# EAGLE design carret (EAGLE 5.11)
A: a
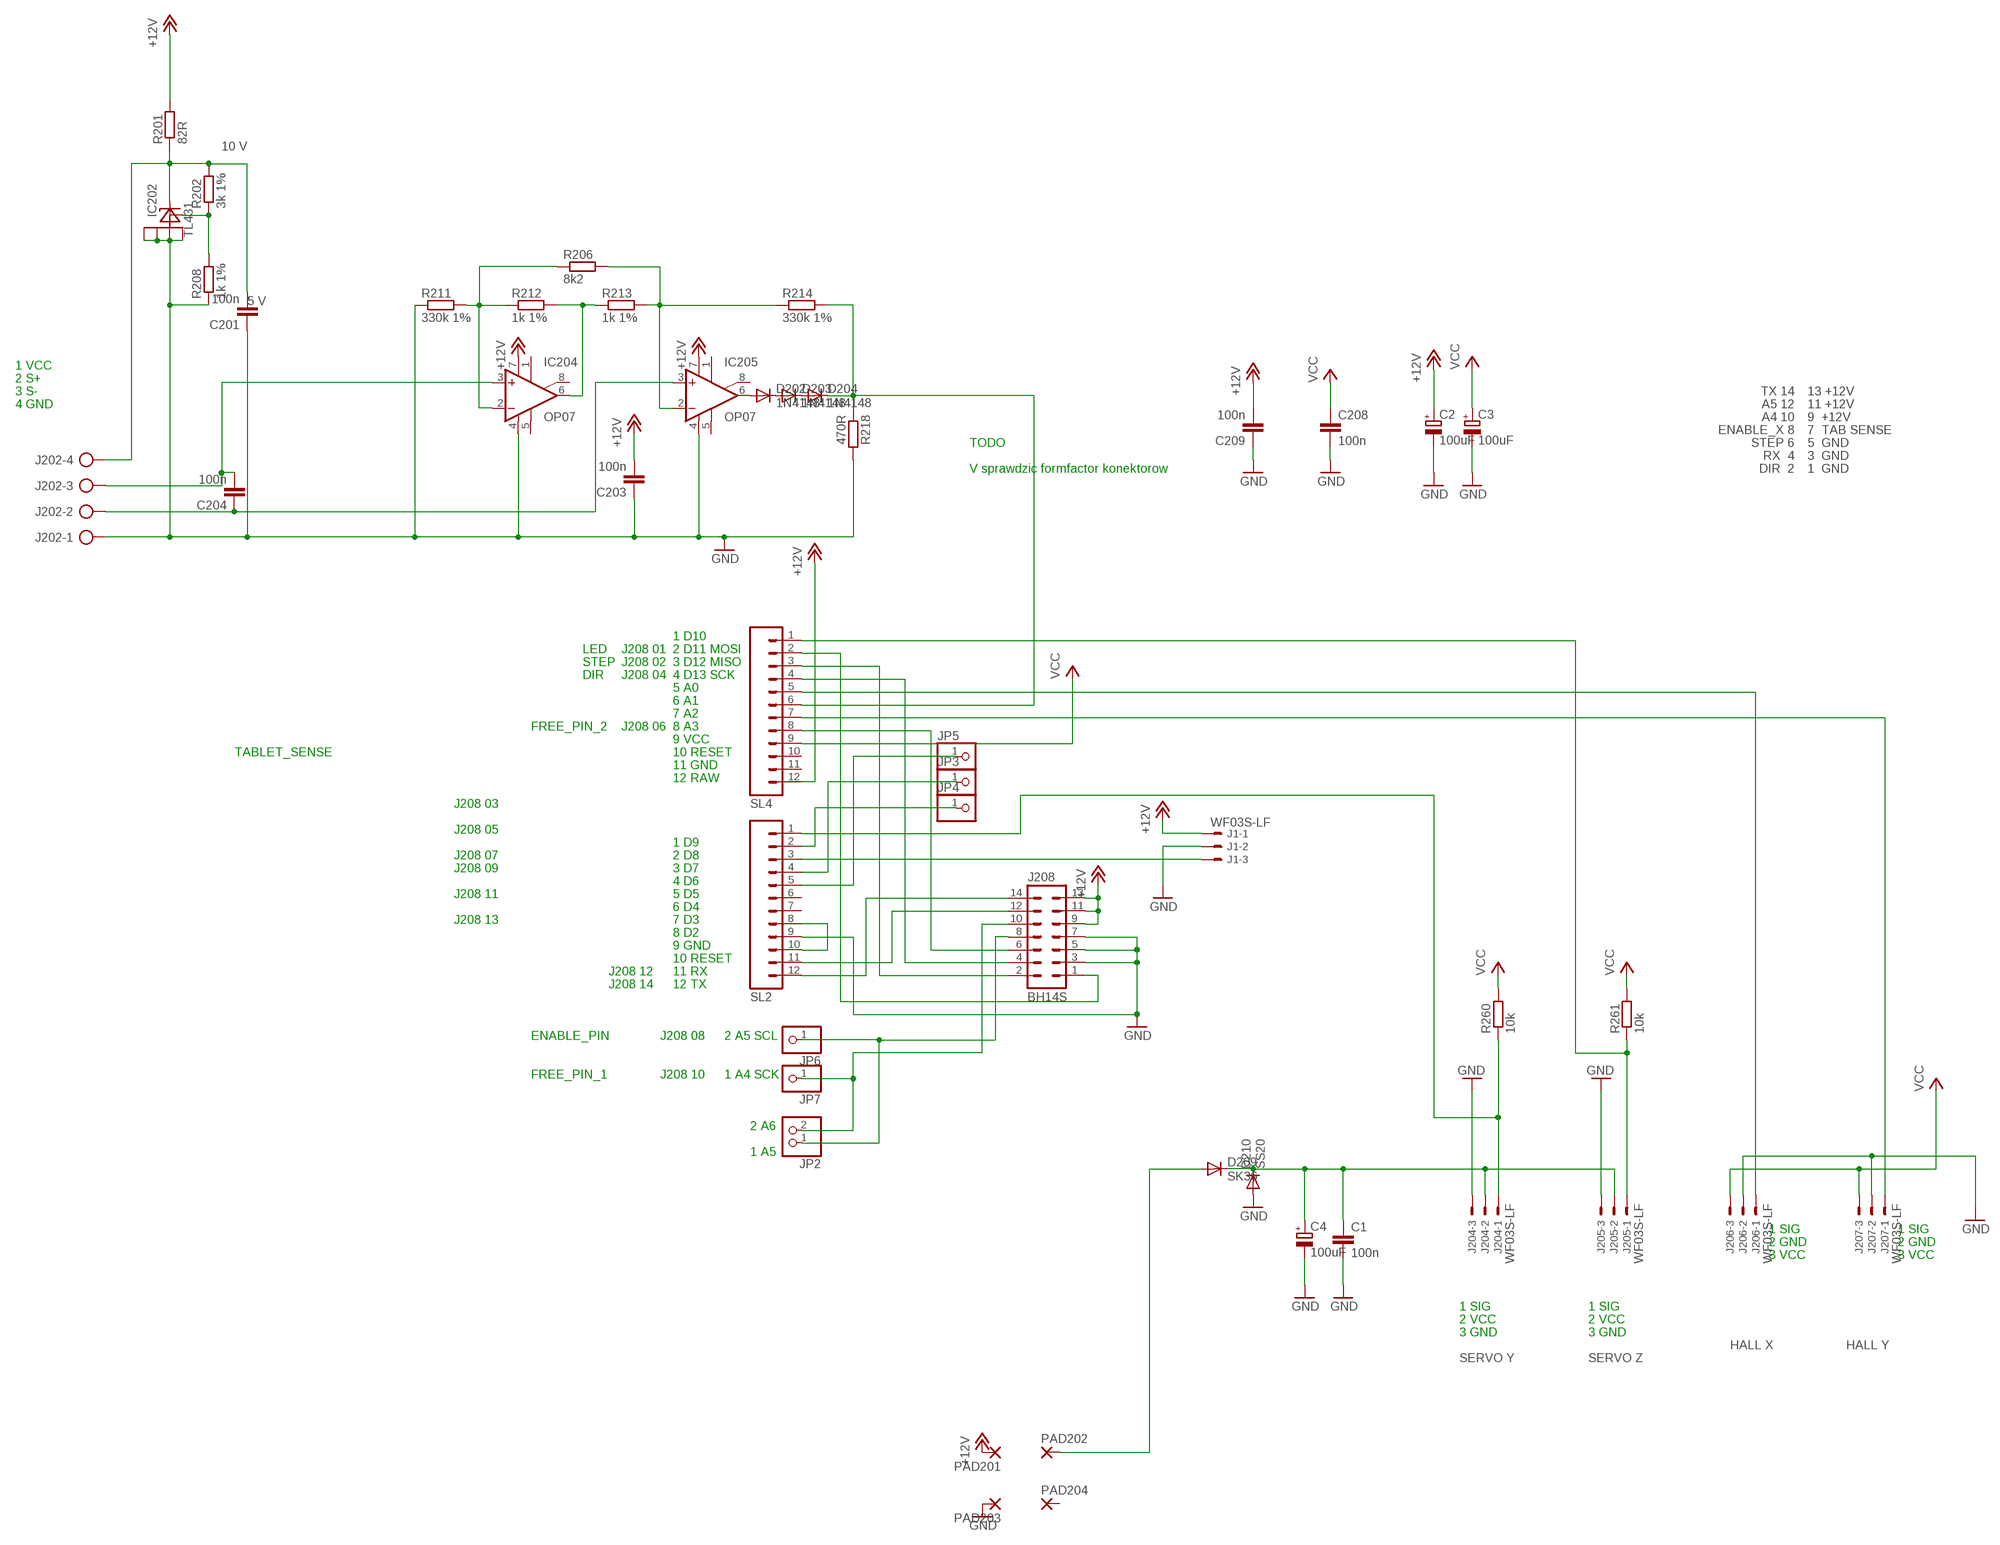
[diagram p0: schematic, sheet 1]

## Parts
C1  100n  CAP  [0805]
C2  100uF  CPOL-EUE3.5-8  [E3,5-8]
C3  100uF  CPOL-EUE3.5-8  [E3,5-8]
C4  100uF  CPOL-EUE3.5-8  [E3,5-8]
C201  100n  CAP  [0805]
C203  100n  CAP  [0805]
C204  100n  CAP  [0805]
C208  100n  CAP  [0805]
C209  100n  CAP  [0805]
D202  1N4148  DIODE-SOD80C  [SOD80C]
D203  1N4148  DIODE-SOD80C  [SOD80C]
D204  1N4148  DIODE-SOD80C  [SOD80C]
D209  SK36  DIODE-SMC  [SMC]
D210  SS20  DIODE-DO214AA  [DO214AA]
IC202  TL431  [SO08]
IC204  OP07  OP07CR  [SO08]
IC205  OP07  OP07CR  [SO08]
J1  WF03S-LF  22-27-2031-03  [6410-03]
J202  AK300/4  [AK300/4]
J204  WF03S-LF  22-27-2031-03  [6410-03]
J205  WF03S-LF  22-27-2031-03  [6410-03]
J206  WF03S-LF  22-27-2031-03  [6410-03]
J207  WF03S-LF  22-27-2031-03  [6410-03]
J208  BH14S  ML14  [ML14]
JP2  PINHD-1X2  [1X02]
JP3  PINHD-1X1  [1X01]
JP4  PINHD-1X1  [1X01]
JP5  PINHD-1X1  [1X01]
JP6  PINHD-1X1  [1X01]
JP7  PINHD-1X1  [1X01]
PAD201  3,81/1,1  [3,81/1,1]
PAD202  3,81/1,1  [3,81/1,1]
PAD203  3,81/1,1  [3,81/1,1]
PAD204  3,81/1,1  [3,81/1,1]
R201  82R  RES0805  [0805]
R202  3k 1%  RES0805  [0805]
R206  8k2  RES0805  [0805]
R208  1k 1%  RES0805  [0805]
R211  330k 1%  RES0805  [0805]
R212  1k 1%  RES0805  [0805]
R213  1k 1%  RES0805  [0805]
R214  330k 1%  RES0805  [0805]
R218  470R  RES0805  [0805]
R260  10k  RES0805  [0805]
R261  10k  RES0805  [0805]
SL2  M12  [12P]
SL4  M12  [12P]

## Nets
+10V: C201.2 IC202.1(K) J202.4 R201.1 R202.2
+12V [power12]: C2.+ C203.2 C209.2 IC204.7(V+) IC205.7(V+) J1.1 J208.9 J208.11 J208.13 PAD201.1(P) R201.2 SL4.12
GND [ground]: C1.2 C2.- C3.- C4.- C201.1 C203.1 C208.2 C209.1 D210.A IC202.2(A) IC202.3(A1) IC202.6(A2) IC202.7(A3) IC204.4(V-) IC205.4(V-) J1.2 J202.1 J204.3 J205.3 J206.2 J207.2 J208.3 J208.5 J208.7 PAD203.1(P) R208.1 R211.1 R218.2 SL2.9
N$1: J204.1 R260.1 SL2.1
N$2: J208.14 SL2.12
N$3: J1.3 SL2.3
N$4: JP4.1 SL2.2
N$5: J206.1 SL4.5
N$6: J208.1 SL4.2
N$7: J208.12 SL2.11
N$8: J208.2 SL4.3
N$9: J208.8 JP2.1 JP6.1
N$10: J205.1 R261.1 SL4.1
N$11 [power12]: C1.1 C4.+ D209.C D210.C J204.2 J205.2
N$12: J208.4 SL4.4
N$13: IC205.2(-IN) R206.2 R213.2 R214.1
N$14 [power12]: D209.A PAD202.1(P)
N$15: SL2.8 SL2.10
N$16: J208.6 SL4.8
N$17: J208.10 JP2.2 JP7.1
N$18: JP3.1 SL2.4
N$19: JP5.1 SL2.5
N$26: J207.1 SL4.7
N$41: D204.C R214.2 R218.1 SL4.6
N$43: IC202.8(REF) R202.1 R208.2
N$49: C204.2 IC204.3(+IN) J202.3
N$50: C204.1 IC205.3(+IN) J202.2
N$51: IC204.2(-IN) R206.1 R211.2 R212.1
N$52: IC204.6(OUT) R212.2 R213.1
N$54: D202.A IC205.6(OUT)
N$55: D202.C D203.A
N$56: D203.C D204.A
VCC [power5]: C3.+ C208.1 J206.3 J207.3 R260.2 R261.2 SL4.9
Unconnected: IC204.1(ON1) IC204.5(OPT) IC204.8(ON2) IC205.1(ON1) IC205.5(OPT) IC205.8(ON2) PAD204.1(P) SL2.6 SL2.7 SL4.10 SL4.11

## Notes on the sheet
- 10 V
- 5 V
- 1 VCC
- 2 S+
- 3 S- | TX 14 | 13 +12V
- 4 GND | A5 12 | 11 +12V
- A4 10 | 9  +12V
- ENABLE_X 8 | 7  TAB SENSE
- TODO | STEP 6 | 5  GND
- RX  4 | 3  GND
- V sprawdzic formfactor konektorow | DIR  2 | 1  GND
- 1 D10
- LED | J208 01 | 2 D11 MOSI
- STEP | J208 02 | 3 D12 MISO
- DIR | J208 04 | 4 D13 SCK
- 5 A0
- 6 A1
- 7 A2
- FREE_PIN_2 | J208 06 | 8 A3
- 9 VCC
- TABLET_SENSE | 10 RESET
- 11 GND
- 12 RAW
- J208 03
- J208 05
- 1 D9
- J208 07 | 2 D8
- J208 09 | 3 D7
- 4 D6
- J208 11 | 5 D5
- 6 D4
- J208 13 | 7 D3
- 8 D2
- 9 GND
- 10 RESET
- J208 12 | 11 RX
- J208 14 | 12 TX
- ENABLE_PIN | J208 08 | 2 A5 SCL
- FREE_PIN_1 | J208 10 | 1 A4 SCK
- 2 A6
- 1 A5
- 1 SIG | 1 SIG
- 2 GND | 2 GND
- 3 VCC | 3 VCC
- 1 SIG | 1 SIG
- 2 VCC | 2 VCC
- 3 GND | 3 GND
- HALL X | HALL Y
- SERVO Y | SERVO Z

## Library data of the parts
C1 C201 C203 C204 C208 C209 = barobot:CAP
C2-C4 = rcl:CPOL-EU: POLARIZED CAPACITOR, European symbol
D202-D204 D209 D210 = diode:DIODE-: DIODE
IC202 = 0alib:TL431
IC204 IC205 = linear:OP07*: OP AMP
J1 J204-J207 = con-molex:22-?-03: CONNECTOR wire to board 2.54 mm (.1 inch) pitch header; OC_FARNELL: unknown; OC_NEWARK: unknown
J202 = con-ptr500:AK300/4: CONNECTOR
J208 = con-ml:ML14: HARTING
JP2 = pinhead:PINHD-1X2: PIN HEADER
JP3-JP7 = pinhead:PINHD-1X1: PIN HEADER
PAD201-PAD204 = wirepad:3,81/1,1: THROUGH-HOLE PAD
R201 R202 R206 R208 R211-R214 R218 R260 R261 = barobot:RES
SL2 SL4 = con-amp-quick:M12: AMP QUICK CONNECTOR; OC_FARNELL: unknown; OC_NEWARK: unknown

## Net classes
0 default: width 0.381 mm, drill 0.254 mm, clearance 0.254 mm
1 power12: width 1.27 mm
2 ground: width 0.508 mm
3 power5: width 0.508 mm

## Board
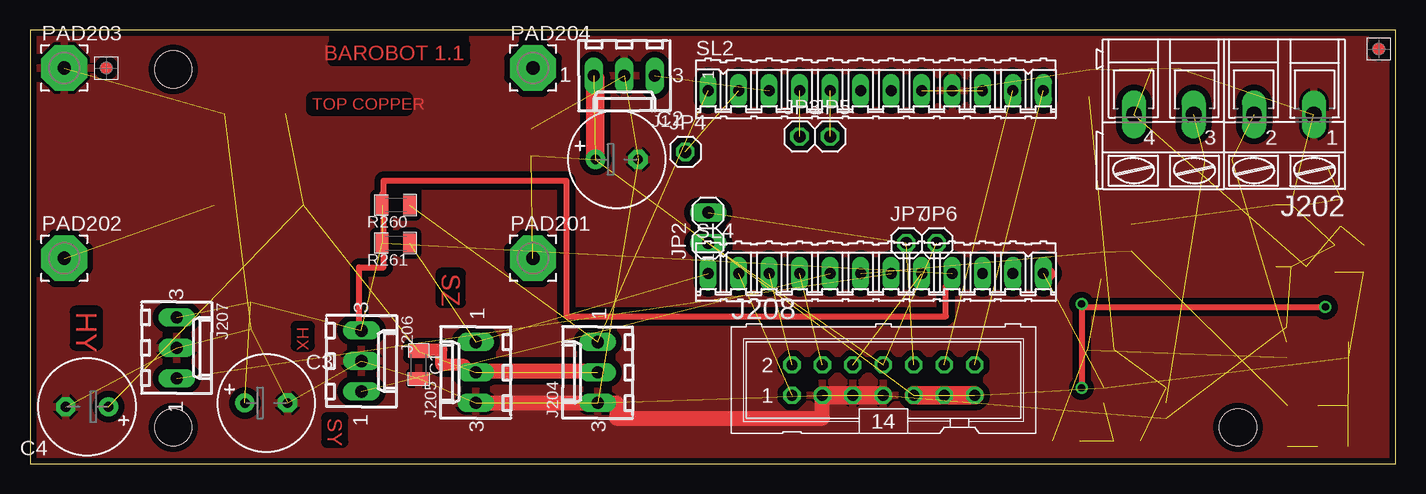
[diagram p1: board, top side]
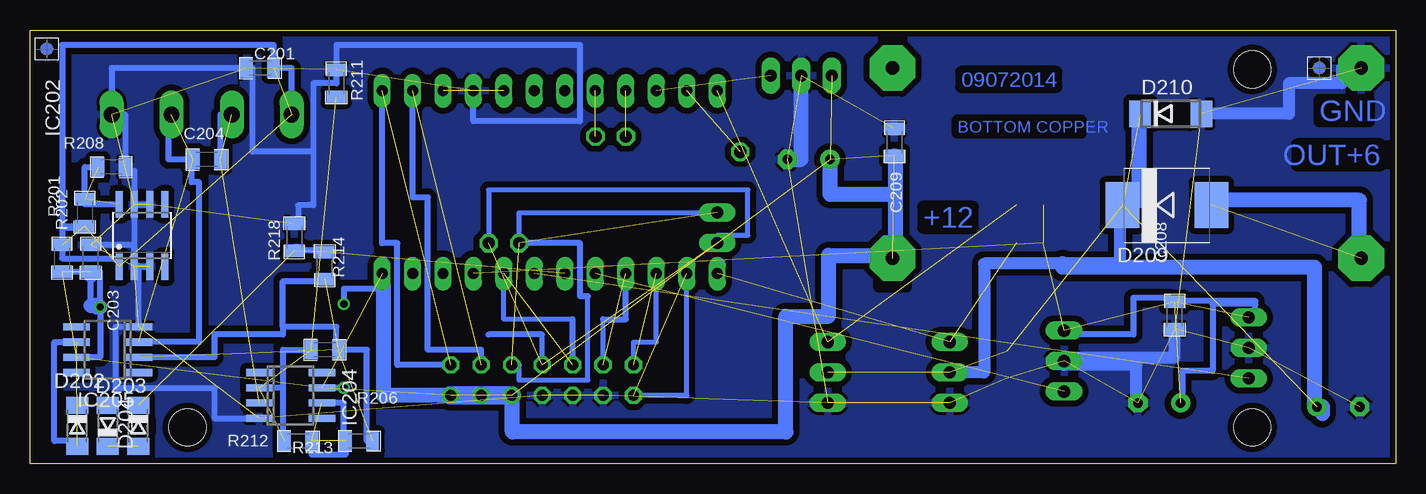
[diagram p2: board, bottom side, seen from below]

Size 113.79 x 36.2 mm. Coordinates in mm from the lower left corner, seen from the top.
Outline: 113.79,0 0,0 0,36.2 113.79,36.2 113.79,0
Outline: 113.79,0 113.79,0
Copper layers (1*16): Top 0.035mm / dielectric 1.5mm / Bottom 0.035mm
Design rules "default *": minimum track width 10mil, minimum drill 0.5mm, track to track 10mil, track to pad 10mil, pad to pad 8mil, via to via 10mil, smd to smd 8mil, copper to edge 20mil, drill to drill 8mil, minimum pad ring 10mil, minimum via ring 8mil, stop-mask expansion 0mil, vias tented up to drill 0mil, thermal gap 10mil
Holes 3.1 mm at 100.67,3.05 11.94,3.05 11.94,32.89
bRestrict: area 17.1,28.3 to 20,29.8; area 103.8,2.5 to 110.8,3.8; area 40.8,14.8 to 43,14.9

### Footprints (pad centres in the part's own frame; a part is rotated, then mirrored left to right if it is on the bottom)
0805 = smd 1.044 x 1.6: 1 -1.127,0; 2 1.127,0
E3,5-8 = drill 0.813 pad 1.6 round: + -1.778,0 | drill 0.813 pad 1.6 octagon: - 1.778,0
SOD80C = smd 1.4 x 1.8: A 1.7,0; C -1.7,0
SMC = smd 2.8 x 3.8: A 3.7,0; C -3.7,0
DO214AA = smd 1.8 x 2.2: A 2.55,0; C -2.55,0
SO08 = smd 0.6 x 2.2: 1 -1.905,-2.6; 2 -0.635,-2.6; 3 0.635,-2.6; 4 1.905,-2.6; 5 1.905,2.6; 6 0.635,2.6; 7 -0.635,2.6; 8 -1.905,2.6
6410-03 = drill 1.016 long: 1 2.54,0; 2 0,0; 3 -2.54,0
AK300/4 = drill 1.321 long: 1 -7.493,0; 2 -2.515,0; 3 2.515,0; 4 7.493,0
ML14 = drill 0.914 octagon: 1 -7.62,-1.27; 2 -7.62,1.27; 3 -5.08,-1.27; 4 -5.08,1.27; 5 -2.54,-1.27; 6 -2.54,1.27; 7 0,-1.27; 8 0,1.27; 9 2.54,-1.27; 10 2.54,1.27; 11 5.08,-1.27; 12 5.08,1.27; 13 7.62,-1.27; 14 7.62,1.27
1X02 = drill 1.016 long: 1 -1.27,0; 2 1.27,0
1X01 = drill 1.016 octagon: 1 0,0
3,81/1,1 = drill 1.118 pad 3.81 octagon: 1 0,0
12P = drill 0.914 long: 1 -13.97,0; 2 -11.43,0; 3 -8.89,0; 4 -6.35,0; 5 -3.81,0; 6 -1.27,0; 7 1.27,0; 8 3.81,0; 9 6.35,0; 10 8.89,0; 11 11.43,0; 12 13.97,0

### Placement (x,y rotation side)
C1  32.38,8.26 270 top
C2  [E3,5-8]  48.9,25.4 0 top
C3  [E3,5-8]  19.68,5.08 0 top
C4  [E3,5-8]  4.76,4.76 180 top
C201  94.61,33.02 0 bottom
C203  108.74,17.15 270 bottom
C204  99.06,25.4 0 bottom
C208  18.41,12.38 270 bottom
C209  41.75,26.83 270 bottom
D202  109.86,3.18 270 bottom
D203  107.31,3.18 90 bottom
D204  104.78,3.18 270 bottom
D209  19.05,21.59 0 bottom
D210  18.73,29.21 0 bottom
IC202  104.46,19.05 0 bottom
IC204  92.08,5.72 270 bottom
IC205  107.31,9.53 90 bottom
J1  49.53,32.39 180 top
J202  99.49,29.15 180 top
J204  47.31,7.62 90 top
J205  37.15,7.62 90 top
J206  27.62,8.57 270 top
J207  12.22,9.68 270 top
J208  71.12,6.99 0 top
JP2  56.52,19.69 90 top
JP3  64.14,27.31 0 top
JP4  54.61,26.04 0 top
JP5  66.67,27.31 0 top
JP6  75.56,18.42 0 top
JP7  73.03,18.42 0 top
PAD201  41.91,17.15 0 top
PAD202  2.86,17.15 0 top
PAD203  2.86,33.02 0 top
PAD204  41.91,33.02 0 top
R201  111.13,17.15 270 bottom
R202  109.22,20.96 270 bottom
R206  89.22,9.53 0 bottom
R208  107,24.77 180 bottom
R211  88.27,31.75 270 bottom
R212  91.44,1.91 0 bottom
R213  86.36,1.91 0 bottom
R214  89.25,16.53 90 bottom
R218  91.76,18.89 90 bottom
R260  30.48,21.59 180 top
R261  30.48,18.42 180 top
SL2  70.48,31.12 0 top
SL4  70.48,15.88 0 top
U$1  [FIDUCIAL_G10S]  6.35,33.02 0 top
U$2  [FIDUCIAL_G10S]  112.39,34.61 0 top
U$3  [FIDUCIAL_G10S]  112.39,34.61 0 bottom
U$4  [FIDUCIAL_G10S]  6.35,33.02 0 bottom

### Tracks (layer width: path | path; a pad name or v marks a point on that pad's centre or on a via)
+10V  (4 unrouted)
  Bottom 0.508: R201.1 111.12,19.69 109.22,19.69 R202.2 111.12,19.83 111.12,34.93 93.49,34.93 C201.2 92,33.02 J202.4 | R201.1 | R201.1 111.12,17.15 106.36,17.15 IC202.1
+12V  (via drill 0.6 pad 0.6)  (11 unrouted)
  Top 0.508: v87.63,13.34 87.63,13.08 | 87.63,13.08 v87.63,6.35 | 87.63,13.08 v107.95,13.08
  Top 1.016: 47.12,32.13 46.99,32.13 J1.1
  Top 1.27: SL4.12 84.84,15.88
  Top 1.524: C2.+ 47.12,32.13 | J208.9 J208.11 J208.13
  Bottom 0.508: R201.2 C203.2 108.74,15.75 108.71,15.75 108.71,13.21 | R201.2 | 108.71,15.88 108.74,15.88 | IC205.7 107.95,8.89 v107.95,13.08 107.95,16.02 | v87.63,6.35 IC204.7 | SL4.12 84.45,14.61 87.63,14.61 v87.63,13.34 87.63,13.08
  Bottom 1.27: SL4.12 84.45,14.86 84.33,14.86 84.33,5.72 J208.13 73.6,5.72 73.6,2.67 50.8,2.67 50.8,12.32 47.24,12.32 47.24,17.4 42.16,17.4 | 42.16,17.4 42.16,17.15 PAD201.1 | 41.66,22.48 41.66,17.91 42.16,17.91 42.16,17.4 | 41.66,22.48 41.66,25.53 41.75,25.53 C209.2 | C2.+ 47.12,22.48 41.66,22.48 | 108.71,15.75 108.71,15.88 | 108.71,13.21 108.2,13.21 108.2,13.08 v107.95,13.08
  Bottom 1.524: J208.13 J208.9
GND  (28 unrouted)
  Top 1.27: J205.3 J204.3 48.9,5.08 48.9,3.81 66.04,3.81 J208.3
  Top 1.524: J208.7 J208.5 J208.3
  Bottom 0.508: C203.1 105.09,18.27 IC202.2 | IC202.7 IC202.2 | IC202.7 IC202.6 | IC202.7 105.09,24.45 105.87,24.45 R208.1 105.87,29.15 J202.1 106.98,33.02 C201.1 95.25,33.02 95.25,26.04 90.17,26.04 | IC202.2 104.78,16.45 | 104.78,16.45 IC202.3 | 90.17,26.04 90.17,31.75 88.27,31.75 R211.1 88.27,34.93 67.94,34.93 67.94,28.58 76.83,28.58 SL2.9 | 90.17,26.04 90.17,21.59 91.44,21.59 91.44,20.32 91.76,20.32 R218.2 | 104.78,11.43 106.68,11.43 106.68,6.35 98.42,6.35 98.42,3.81 IC204.4 | 104.78,16.45 104.78,11.43 | 104.78,16.45 104.78,16.51 | 104.78,11.43 IC205.4
  Bottom 1.016: C3.- 21.59,5.08 21.59,8.26 27.62,8.26 J206.2 27.3,8.57 27.3,8.89 18.41,8.89 C208.2 | D210.A 8.89,29.21 8.89,31.75 4.45,31.75 4.45,33.02 PAD203.1
  Bottom 1.27: C2.- 49.53,25.4 J1.2
  pour Top (isolate 0.508, rank 3): 0,36.2 113.67,36.2 113.67,0 0,0
  pour Bottom (isolate 0.508): 0,36.2 113.67,36.2 113.79,0 0,0
N$1  (2 unrouted)
N$2  (1 unrouted)
  Bottom 0.508: SL2.12 84.45,18.42 83.19,18.42 83.19,8.26 J208.14
N$3  (1 unrouted)
N$4  (1 unrouted)
N$5  (1 unrouted)
N$6  (1 unrouted)
  Bottom 0.406: SL4.2 59.05,5.72 J208.1
N$7  (1 unrouted)
  Bottom 0.508: SL2.11 81.92,22.23 80.64,22.23 80.64,9.53 76.2,9.53 J208.12
N$8  (1 unrouted)
  Bottom 0.406: SL4.3 61.59,10.16 63.5,10.16 J208.2
N$9  (2 unrouted)
  Bottom 0.406: J208.8 71.12,10.8 | JP2.1 56.52,19.05 53.98,19.05 53.98,22.86 75.56,22.86 JP6.1
  Bottom 0.508: 71.12,10.8 75.56,10.8
N$10  (2 unrouted)
N$11  (5 unrouted)
  Top 1.016: 47.31,7.75 J204.2 | 37.59,7.75 37.59,7.62 J205.2 36.2,7.62 36.2,8.26 34.29,8.26 34.29,9.53 32.38,9.53 C1.1
  Top 1.27: 37.59,7.75 47.31,7.75
  Bottom 1.016: 22.92,21.53 22.92,16.7 27.75,16.7 34.29,16.7 34.29,7.62 J205.2 | 22.86,21.53 22.86,21.59
  Bottom 1.27: D210.C 21.28,29.08 21.34,29.08 21.34,21.97 22.35,21.97 22.35,21.59 D209.C 22.75,21.46 22.86,21.46 22.86,21.53 22.92,21.53 | 6.1,4.19 6.1,4.76 C4.+ 6.73,4.76 6.73,16.38 27.75,16.38 27.75,16.7
N$12  (1 unrouted)
  Bottom 0.406: J208.4 66.04,12.07
  Bottom 0.508: SL4.4 64.14,12.07 66.04,12.07
N$13  (3 unrouted)
  Bottom 0.508: R213.2 85.72,1.91 85.72,9.53 R206.2 88.27,9.53 88.27,11.43 92.71,11.43 | IC205.2 98.42,8.89 98.42,10.8 92.71,10.8 92.71,11.43 | 92.71,11.43 92.71,15.24 89.53,15.24
N$14  (1 unrouted)
  Bottom 1.016: 15.24,22 15.24,21.97 15.35,21.97
  Bottom 1.27: D209.A 15.35,21.46 15.24,21.46 15.24,22 3.02,22 3.02,17.4 3.05,17.4 3.05,17.15 PAD202.1
N$15  (1 unrouted)
N$16  (1 unrouted)
  Bottom 0.406: 68.58,12.07 74.3,12.07 SL4.8
  Bottom 0.508: J208.6 68.58,12.07
N$17  (2 unrouted)
  Bottom 0.406: 73.03,8.26 73.03,6.99 67.31,6.99 67.31,13.97 | JP2.2 73.03,20.96 JP7.1
  Bottom 0.508: 73.03,8.26 J208.10 | 67.31,13.97 67.94,13.97 67.94,18.42 JP7.1
N$18  (1 unrouted)
N$19  (1 unrouted)
N$26  (1 unrouted)
N$41  (3 unrouted)
  Bottom 0.508: 91.76,17.78 91.76,18.08 91.44,18.08 91.44,17.78 | 91.44,17.78 89.53,17.78 89.53,17.66 R214.2 | 91.44,17.78 91.76,17.78 | 91.76,17.78 R218.1
N$43  (2 unrouted)
  Bottom 0.508: R208.2 109.22,24.77 R202.1 109.22,21.65 IC202.8
N$49  (2 unrouted)
  Bottom 0.508: J202.3 97.93,29.15 C204.2
N$50  (2 unrouted)
  Bottom 0.508: 100.33,25.4 100.33,23.5 99.69,23.5 99.69,10.16 IC205.3 | 100.33,25.4 102.23,25.4 102.23,28.58 102,28.58 J202.2 | 100.33,25.4 C204.1
N$51  (3 unrouted)
  Bottom 0.508: 92.71,1.91 R212.1 | 92.71,1.91 92.71,1.27 | 92.71,6.35 92.71,1.91 | 92.71,6.35 IC204.2 | 92.71,6.35 92.71,9.53 R206.1
N$52  (2 unrouted)
  Bottom 0.508: R212.2 90.31,0.78 87.49,0.78 R213.1 87.63,1.91 87.63,5.08 IC204.6
N$54  (1 unrouted)
  Bottom 0.508: IC205.6 111.76,10.16 111.76,1.91 109.86,1.91 D202.A
N$55  (1 unrouted)
N$56  (1 unrouted)
VCC  (6 unrouted)
  Top 0.508: 27.62,11.3 J206.3 27.43,11.11 27.43,16.38 29.46,16.38 29.46,18.42 | 29.46,18.42 29.46,21.59 | 29.46,21.59 29.46,22.48 | 29.46,22.48 29.35,22.48 R260.2 29.46,21.59 | 29.46,18.42 R261.2 | SL4.9 76.71,15.88 76.71,14.86 76.33,14.86 76.33,12.32 44.7,12.32 44.7,23.62 29.46,23.62 29.46,22.48
  Bottom 0.508: J207.3 11.68,12.22 11.68,13.34 | 11.68,13.34 11.68,13.59 18.41,13.59 C208.1 18.8,13.51 18.8,13.84 21.84,13.84 21.84,10.8 27.62,10.8 J206.3 | 11.68,13.34 15.24,13.34 15.24,7.75 17.78,7.75 17.78,5.08 C3.+

### Text on the board
Top: BAROBOT 1.1 | TOP COPPER | SZ | HY | HX | SY
Bottom: 09072014 | GND | BOTTOM COPPER | OUT+6 | +12